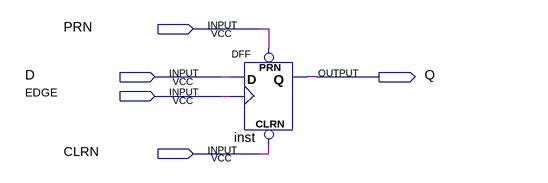
[diagram p0: schematic sheet]
// Quartus schematic Shameem_03132022_D_FlipFlop_As_Symbol_VHDL.bdf as structural Verilog: 1 symbols, 5 pins
module Shameem_03132022_D_FlipFlop_As_Symbol_VHDL (
  input  PRN,
  input  D,
  input  EDGE,
  input  CLRN,
  output Q
);

  DFF inst (.CLRN(CLRN), .CLK(EDGE), .D(D), .PRN(PRN), .Q(Q));
endmodule
